# Altium project PCB_Project-2541.PrjPCB
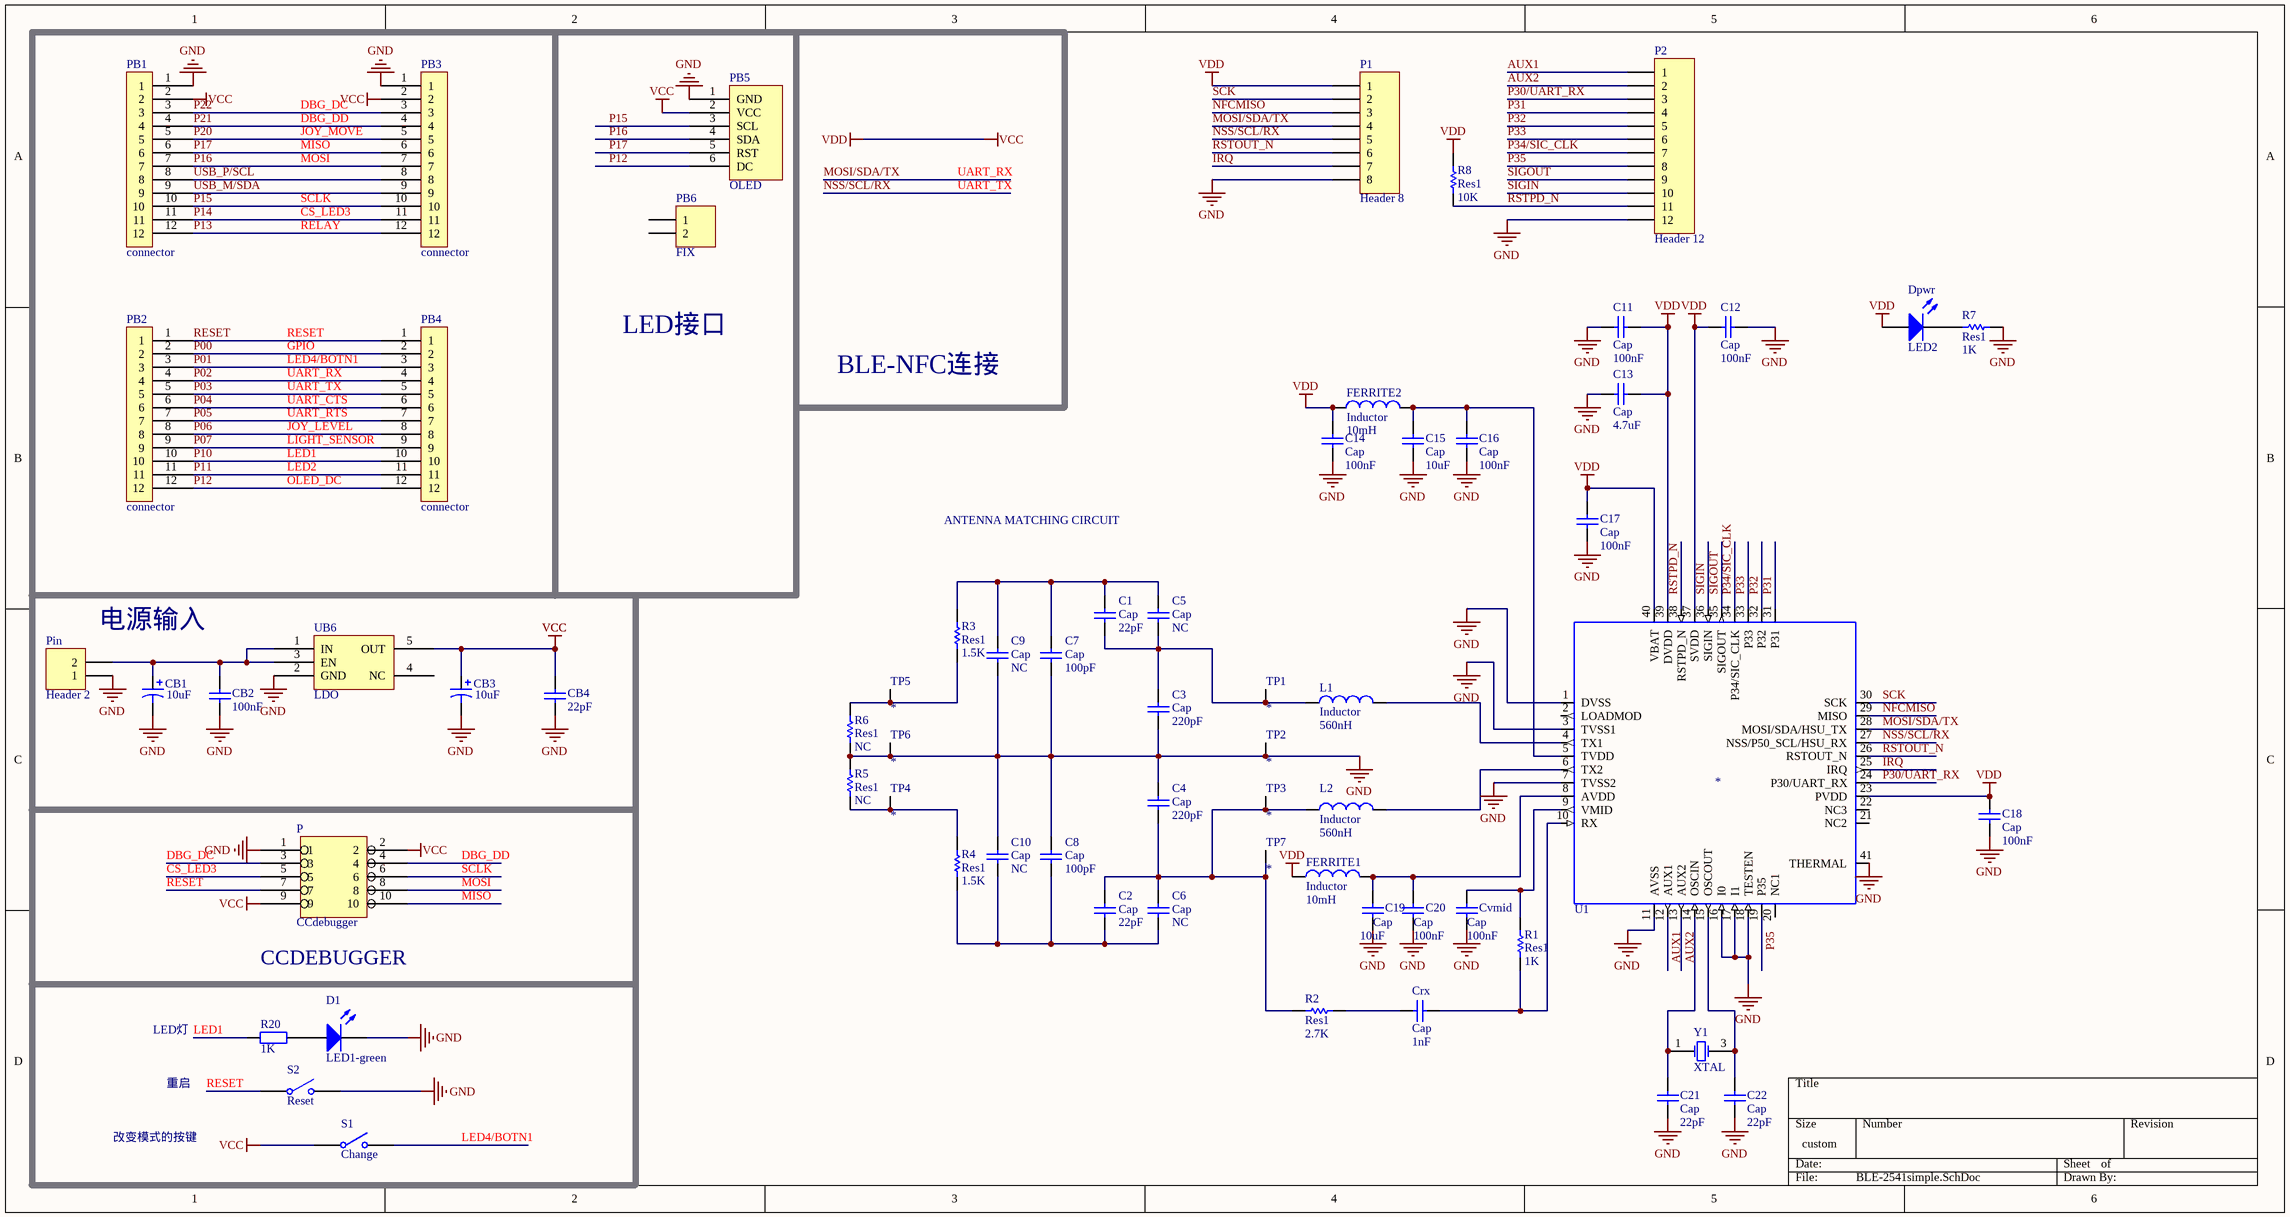
[diagram p0: BLE-2541simple.SchDoc]
1 sheet, 65 parts. Net scope: global (net labels, ports and power ports of the same name join across sheets).
Board file: 2541PCB2.PcbDoc

## Sheet BLE-2541simple.SchDoc
size 431 x 228 mm

### Parts
C1  Cap  value 22pF  [6-0805_M]
C2  Cap  value 22pF  [6-0805_M]
C3  Cap  value 220pF  [6-0805_M]
C4  Cap  value 220pF  [6-0805_M]
C5  Cap  value NC  [6-0805_M]
C6  Cap  value NC  [6-0805_M]
C7  Cap  value 100pF  [6-0805_M]
C8  Cap  value 100pF  [6-0805_M]
C9  Cap  value NC  [6-0805_M]
C10  Cap  value NC  [6-0805_M]
C11  Cap  value 100nF  [6-0805_M]
C12  Cap  value 100nF  [6-0805_M]
C13  Cap  value 4.7uF  [6-0805_M]
C14  Cap  value 100nF  [6-0805_M]
C15  Cap  value 10uF  [6-0805_M]
C16  Cap  value 100nF  [6-0805_M]
C17  Cap  value 100nF  [6-0805_M]
C18  Cap  value 100nF  [6-0805_M]
C19  Cap  value 10uF  [6-0805_M]
C20  Cap  value 100nF  [6-0805_M]
C21  Cap  value 22pF  [6-0805_M]
C22  Cap  value 22pF  [6-0805_M]
CB1  value 10uF  [0805-SMALL]  (hidden comment: Cap Pol1)
CB2  value 100nF  [0805-SMALL]  (hidden comment: Cap)
CB3  value 10uF  [0805-SMALL]  (hidden comment: Cap Pol1)
CB4  value 22pF  [0805-SMALL]  (hidden comment: Cap)
Crx  Cap  value 1nF  [6-0805_M]
Cvmid  Cap  value 100nF  [6-0805_M]
D1  LED1-green  [3.2X1.6X1.1]
Dpwr  LED2  [6-0805_M]
FERRITE1  Inductor  value 10mH  [6-0805_M]
FERRITE2  Inductor  value 10mH  [6-0805_M]
L1  Inductor  value 560nH  [6-0805_M]
L2  Inductor  value 560nH  [6-0805_M]
P  CCdebugger  [M-IDC10]
P1  Header 8  [HDR1X8]
P2  Header 12  [HDR1X12]
PB1  connector  [M-IDC12M]
PB2  connector  [M-IDC12M]
PB3  connector  [M-IDC12]
PB4  connector  [M-IDC12]
PB5  OLED  [M-SIP6]
PB6  FIX  [M-SIP2]
Pin  Header 2  [M-SIP2]
R1  Res1  value 1K  [6-0805_M]
R2  Res1  value 2.7K  [6-0805_M]
R3  Res1  value 1.5K  [6-0805_M]
R4  Res1  value 1.5K  [6-0805_M]
R5  Res1  value NC  [6-0805_M]
R6  Res1  value NC  [6-0805_M]
R7  Res1  value 1K  [6-0805_M]
R8  Res1  value 10K  [6-0805_M]
R20  value 1K  [0805-SMALL]  (hidden comment: Res2)
S1  Change  [MY-KEY1]
S2  Reset  [MY-KEY1]
TP1  *  [PCBComponent_1]
TP2  *  [PCBComponent_1]
TP3  *  [PCBComponent_1]
TP4  *  [PCBComponent_1]
TP5  *  [PCBComponent_1]
TP6  *  [PCBComponent_1]
TP7  *  [PCBComponent_1]
U1  *  [QFN50P600X600X85_HS-41N]
UB6  LDO  [SOT23-5]
Y1  XTAL  [CRYSTAL_3225]

### Blocks framed on the sheet
LED接口: PB5 PB6
电源输入: CB1-CB4 Pin UB6
CCDEBUGGER: P

### Nets
GND: C3.1 C4.2 C7.1 C8.2 C9.1 C10.2 C11.1 C12.2 C13.1 C14.1 C15.1 C16.1 C17.1 C18.2 C19.1 C20.1 C21.2 C22.2 CB1.2 CB2.1 CB3.2 CB4.1 Cvmid.1 D1.2(K) P.1 P1.8 P2.12 PB1.1 PB3.1 PB5.1(GND) Pin.1 R5.2 R6.1 R7.2 S2.2(NO) TP2.1(P$1) TP6.1(P$1) U1.1(DVSS) U1.3(TVSS1) U1.7(TVSS2) U1.11(AVSS) U1.16(I0) U1.17(I1) U1.18(TESTEN) U1.41(THERMAL) UB6.2(GND)
VCC: C11.2 C12.1 C13.2 C14.2 C17.2 C18.1 CB3.1 CB4.2 Dpwr.1(A) FERRITE1.1 FERRITE2.1 P.2 P.9 P1.1 PB1.2 PB3.2 PB5.2(VCC) R8.1 S1.1(COMMON) U1.23(PVDD) U1.37(SVDD) U1.39(DVDD) U1.40(VBAT) UB6.5(OUT)  [also labelled VDD]
AUX1: P2.1 U1.12(AUX1)
AUX2: P2.2 U1.13(AUX2)
CS_LED3: P.5 PB1.11 PB3.11  [also labelled P14]
DBG_DC: P.3 PB1.3 PB3.3  [also labelled P22]
DBG_DD: P.4 PB1.4 PB3.4  [also labelled P21]
GPIO: PB2.2 PB4.2  [also labelled P00]
IRQ: P1.7 U1.25(IRQ)
JOY_LEVEL: PB2.8 PB4.8  [also labelled P06]
JOY_MOVE: PB1.5 PB3.5  [also labelled P20]
LED1: PB2.10 PB4.10 R20.1  [also labelled P10]
LED2: PB2.11 PB4.11  [also labelled P11]
LED4/BOTN1: PB2.3 PB4.3 S1.2(NO)  [also labelled P01]
LIGHT_SENSOR: PB2.9 PB4.9  [also labelled P07]
MISO: P.10 PB1.6 PB3.6 PB5.5(RST)  [also labelled P17]
MOSI: P.8 PB1.7 PB3.7 PB5.4(SDA)  [also labelled P16]
MOSI/SDA/TX: P1.4 PB2.4 PB4.4 U1.28(MOSI/SDA/HSU_TX)  [also labelled P02, UART_RX]
NFCMISO: P1.3 U1.29(MISO)
NSS/SCL/RX: P1.5 PB2.5 PB4.5 U1.27(NSS/P50_SCL/HSU_RX)  [also labelled P03, UART_TX]
OLED_DC: PB2.12 PB4.12 PB5.6(DC)  [also labelled P12]
P04: PB2.6 PB4.6  [also labelled UART_CTS]
P05: PB2.7 PB4.7  [also labelled UART_RTS]
P13: PB1.12 PB3.12  [also labelled RELAY]
P15: P.6 PB1.10 PB3.10 PB5.3(SCL)  [also labelled SCLK]
P30/UART_RX: P2.3 U1.24(P30/UART_RX)
P31: P2.4 U1.31(P31)
P32: P2.5 U1.32(P32)
P33: P2.6 U1.33(P33)
P34/SIC_CLK: P2.7 U1.34(P34/SIC_CLK)
P35: P2.8 U1.19(P35)
RESET: P.7 PB2.1 PB4.1 S2.1(COMMON)
RSTOUT_N: P1.6 U1.26(RSTOUT_N)
RSTPD_N: P2.11 R8.2 U1.38(RSTPD_N)
SCK: P1.2 U1.30(SCK)
SIGIN: P2.10 U1.36(SIGIN)
SIGOUT: P2.9 U1.35(SIGOUT)
USB_M/SDA: PB1.9 PB3.9
USB_P/SCL: PB1.8 PB3.8
NetC1_1: C1.1 C3.2 C5.1 L1.1 TP1.1(P$1)
NetC1_2: C1.2 C5.2 C7.2 C9.2 R3.2
NetC2_1: C2.1 C6.1 C8.1 C10.1 R4.1
NetC2_2: C2.2 C4.1 C6.2 L2.1 R2.2 TP3.1(P$1) TP7.1(P$1)
NetC15_2: C15.2 C16.2 FERRITE2.2 U1.5(TVDD)
NetC19_2: C19.2 C20.2 FERRITE1.2 U1.8(AVDD)
NetC21_1: C21.1 U1.14(OSCIN) Y1.1(OSC1)
NetC22_1: C22.1 U1.15(OSCOUT) Y1.3(OSC2)
NetCB1_1: CB1.1 CB2.2 Pin.2 UB6.1(IN) UB6.3(EN)
NetCrx_1: Crx.1 R1.1 U1.10(RX)
NetCrx_2: Crx.2 R2.1
NetCvmid_2: Cvmid.2 R1.2 U1.9(VMID)
NetD1_1: D1.1(A) R20.2
NetDpwr_2: Dpwr.2(K) R7.1
NetL1_2: L1.2 U1.4(TX1)
NetL2_2: L2.2 U1.6(TX2)
NetR3_1: R3.1 R6.2 TP5.1(P$1)
NetR4_2: R4.2 R5.1 TP4.1

Not connected (* = marked no-connect by the designer): PB6 1 2; U1 2(LOADMOD) 20(NC1) 21(NC2) 22(NC3); UB6 4(NC)

### Notes on the sheet
- BLE-NFC连接
- ANTENNA MATCHING CIRCUIT
- LED灯
- 重启
- 改变模式的按键

### Library data of the parts
C1-C22 CB2 CB4 Crx Cvmid = Cap: Capacitor; Published: 8-Jun-2000; LatestRevisionDate: 17-Jul-2002; LatestRevisionNote: Re-released for DXP Platform.; PackageReference: RAD-0.3; Publisher: Altium Limited; PackageDescription: Radial Cap, Thru-Hole; 2 Leads; 0.3 in Pin Spacing
CB1 CB3 = Cap Pol1: Polarized Capacitor (Radial); Published: 8-Jun-2000; LatestRevisionDate: 17-Jul-2002; LatestRevisionNote: Re-released for DXP Platform.; PackageReference: RB7.6-15; Publisher: Altium Limited; PackageDescription: Polarized Capacitor (Radial); 2 Leads
D1 Dpwr = LED2: Typical RED, GREEN, YELLOW, AMBER GaAs LED; Published: 8-Jun-2000; LatestRevisionDate: 17-Jul-2002; LatestRevisionNote: Re-released for DXP Platform.; PackageVersion: Feb-2002; PackageReference: 3.2X1.6X1.1; Publisher: Altium Limited; PackageDescription: SM LED; 2 Flat Leads
FERRITE1 FERRITE2 L1 L2 = Inductor: Code_IEC: 1005; Published: 8-Jun-2000; LatestRevisionDate: 29-May-2009; LatestRevisionNote: IPC-7351 Footprint Added.; PackageReference: 0402-A; Publisher: Altium Limited; PackageDescription: Chip Inductor; Code_JEITA: 0402
P1 = Header 8: Header, 8-Pin; LatestRevisionDate: 17-Jul-2002; LatestRevisionNote: Re-released for DXP Platform.; Publisher: Altium Limited
P2 = Header 12: Header, 12-Pin; LatestRevisionDate: 17-Jul-2002; LatestRevisionNote: Re-released for DXP Platform.; Publisher: Altium Limited
PB6 Pin = Header 2: Header, 2-Pin; LatestRevisionDate: 17-Jul-2002; LatestRevisionNote: Re-released for DXP Platform.; Publisher: Altium Limited
R1-R8 = Res1: Resistor; Published: 8-Jun-2000; LatestRevisionDate: 17-Jul-2002; LatestRevisionNote: Re-released for DXP Platform.; PackageReference: AXIAL-0.3; Publisher: Altium Limited; PackageDescription: Axial Device, Thru-Hole; 2 Leads; 0.3 in Pin Spacing
R20 = Res2: Resistor; Published: 8-Jun-2000; LatestRevisionDate: 17-Jul-2002; LatestRevisionNote: Re-released for DXP Platform.; PackageReference: AXIAL-0.4; Publisher: Altium Limited; PackageDescription: Axial Device, Thru-Hole; 2 Leads; 0.4 in Pin Spacing
S1 S2 = SW-SPST: Single-Pole, Single-Throw Switch; Published: 24-Mar-1999; LatestRevisionDate: 17-Jul-2002; LatestRevisionNote: Re-released for DXP Platform.; PackageReference: SPST-2; Publisher: Altium Limited; PackageDescription: Switch; 2 Leads
TP1-TP7 = TESTPOINTPAD
U1 = PN532
Y1 = XTAL: Crystal Oscillator; Published: 8-Jun-2000; LatestRevisionDate: 17-Jul-2002; LatestRevisionNote: Re-released for DXP Platform.; PackageReference: R38; Publisher: Altium Limited; PackageDescription: Crystal, Thru-Hole; 2 Leads; Body 3.1 x 8.2 mm (Dia.xH)